# EAGLE schematic full_schema (EAGLE 9.6.2)
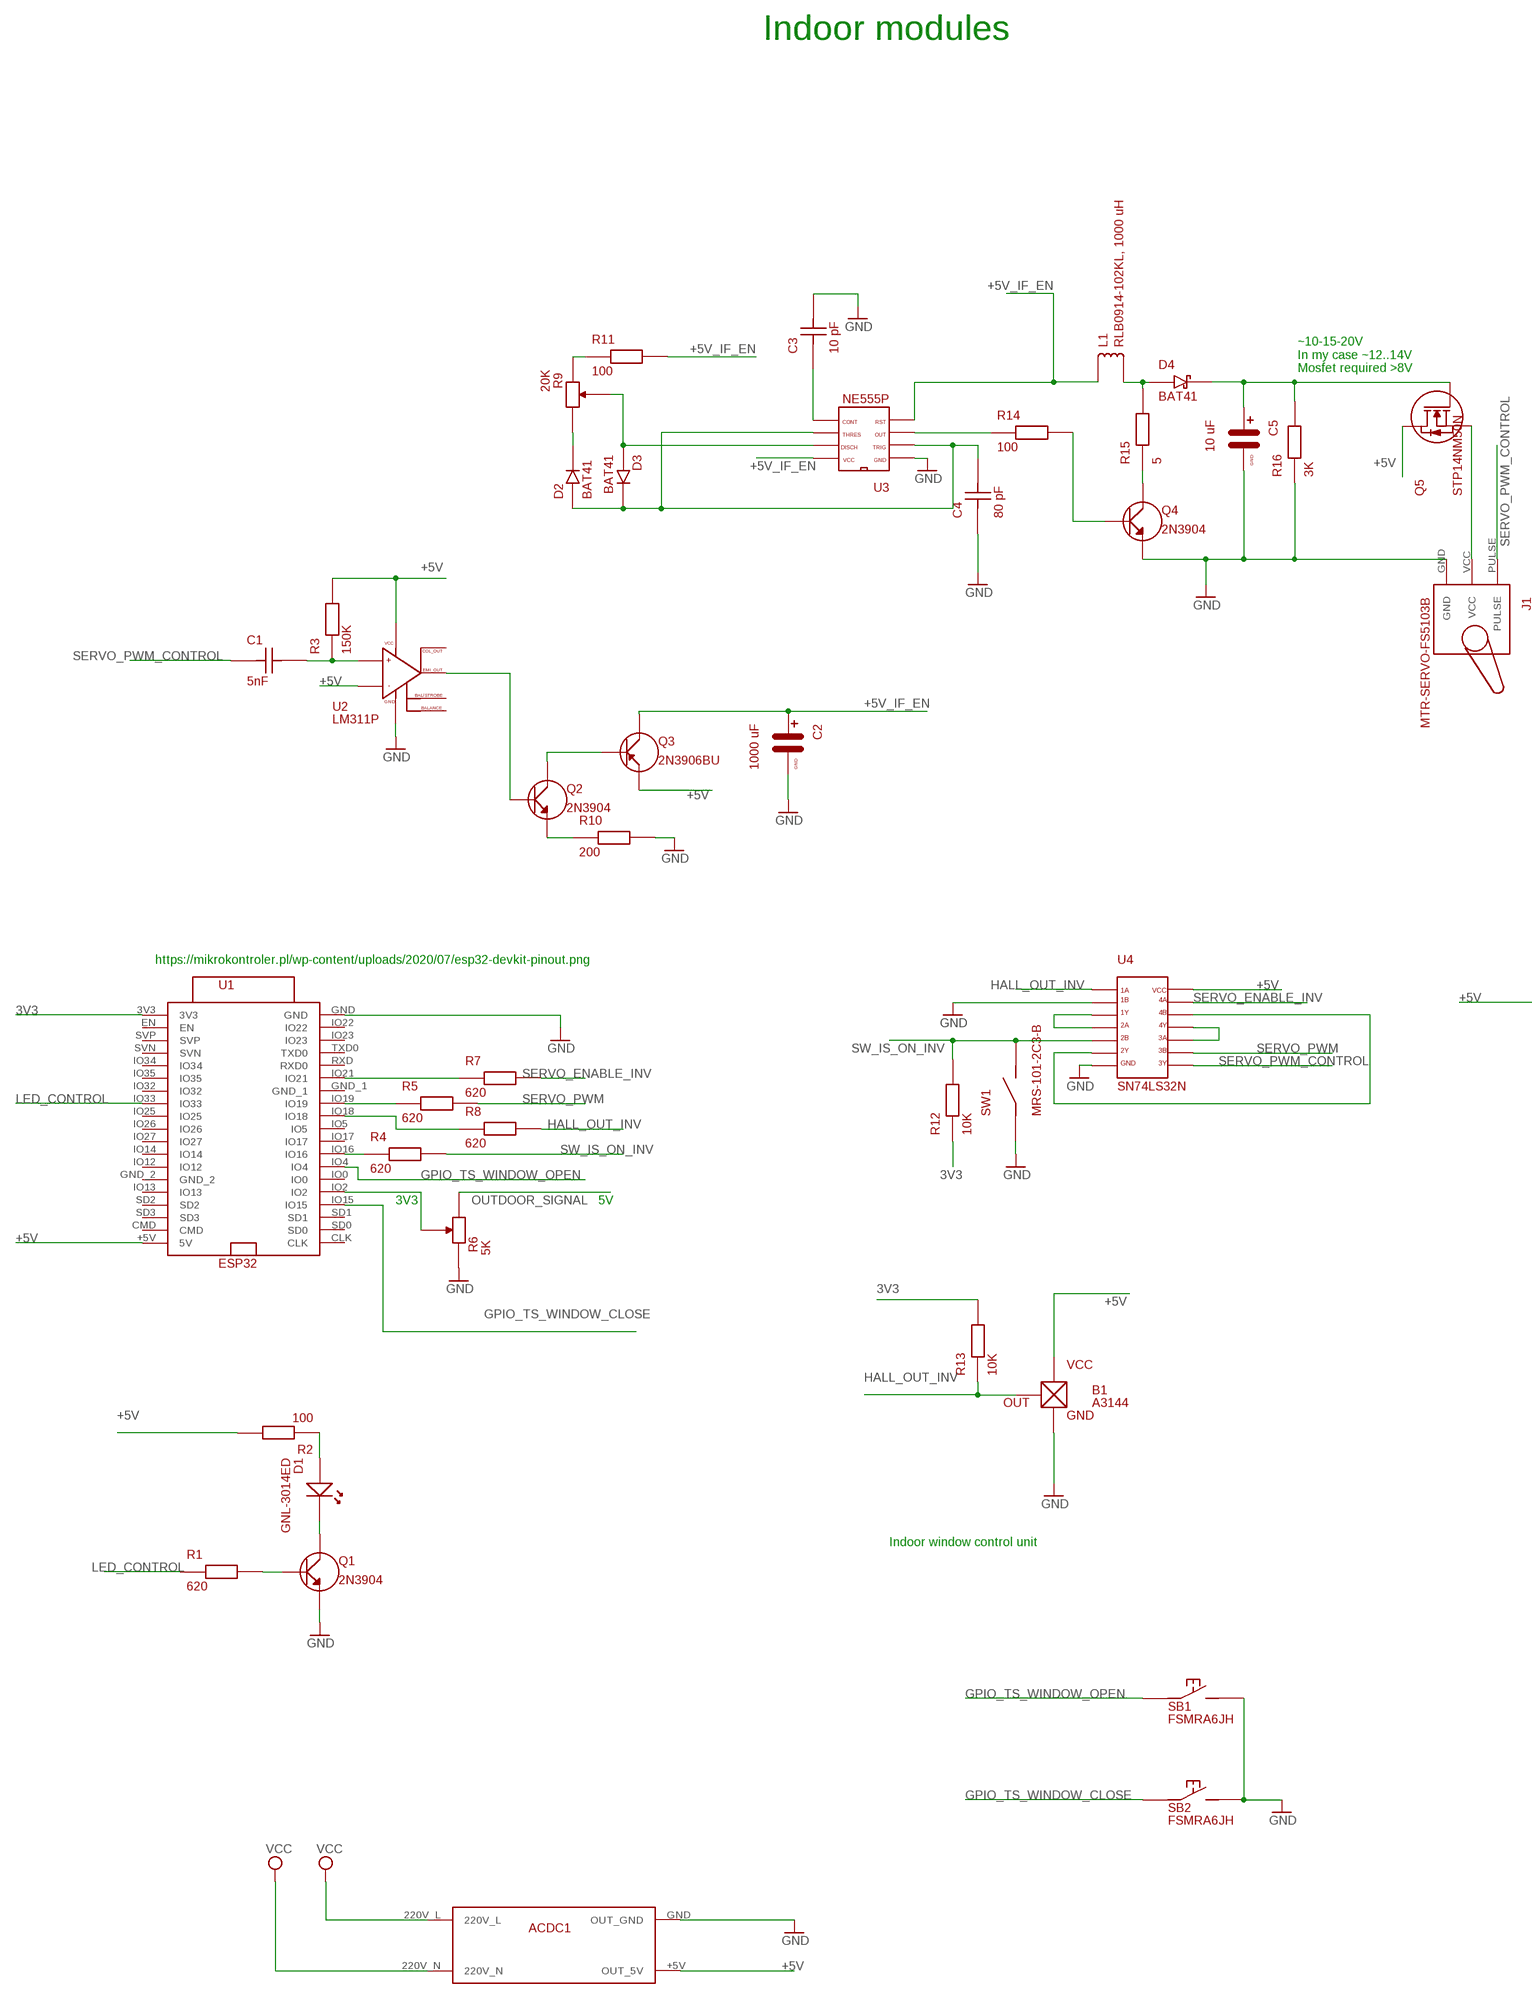
[diagram p0: schematic, sheet 1, part 1 of 2]
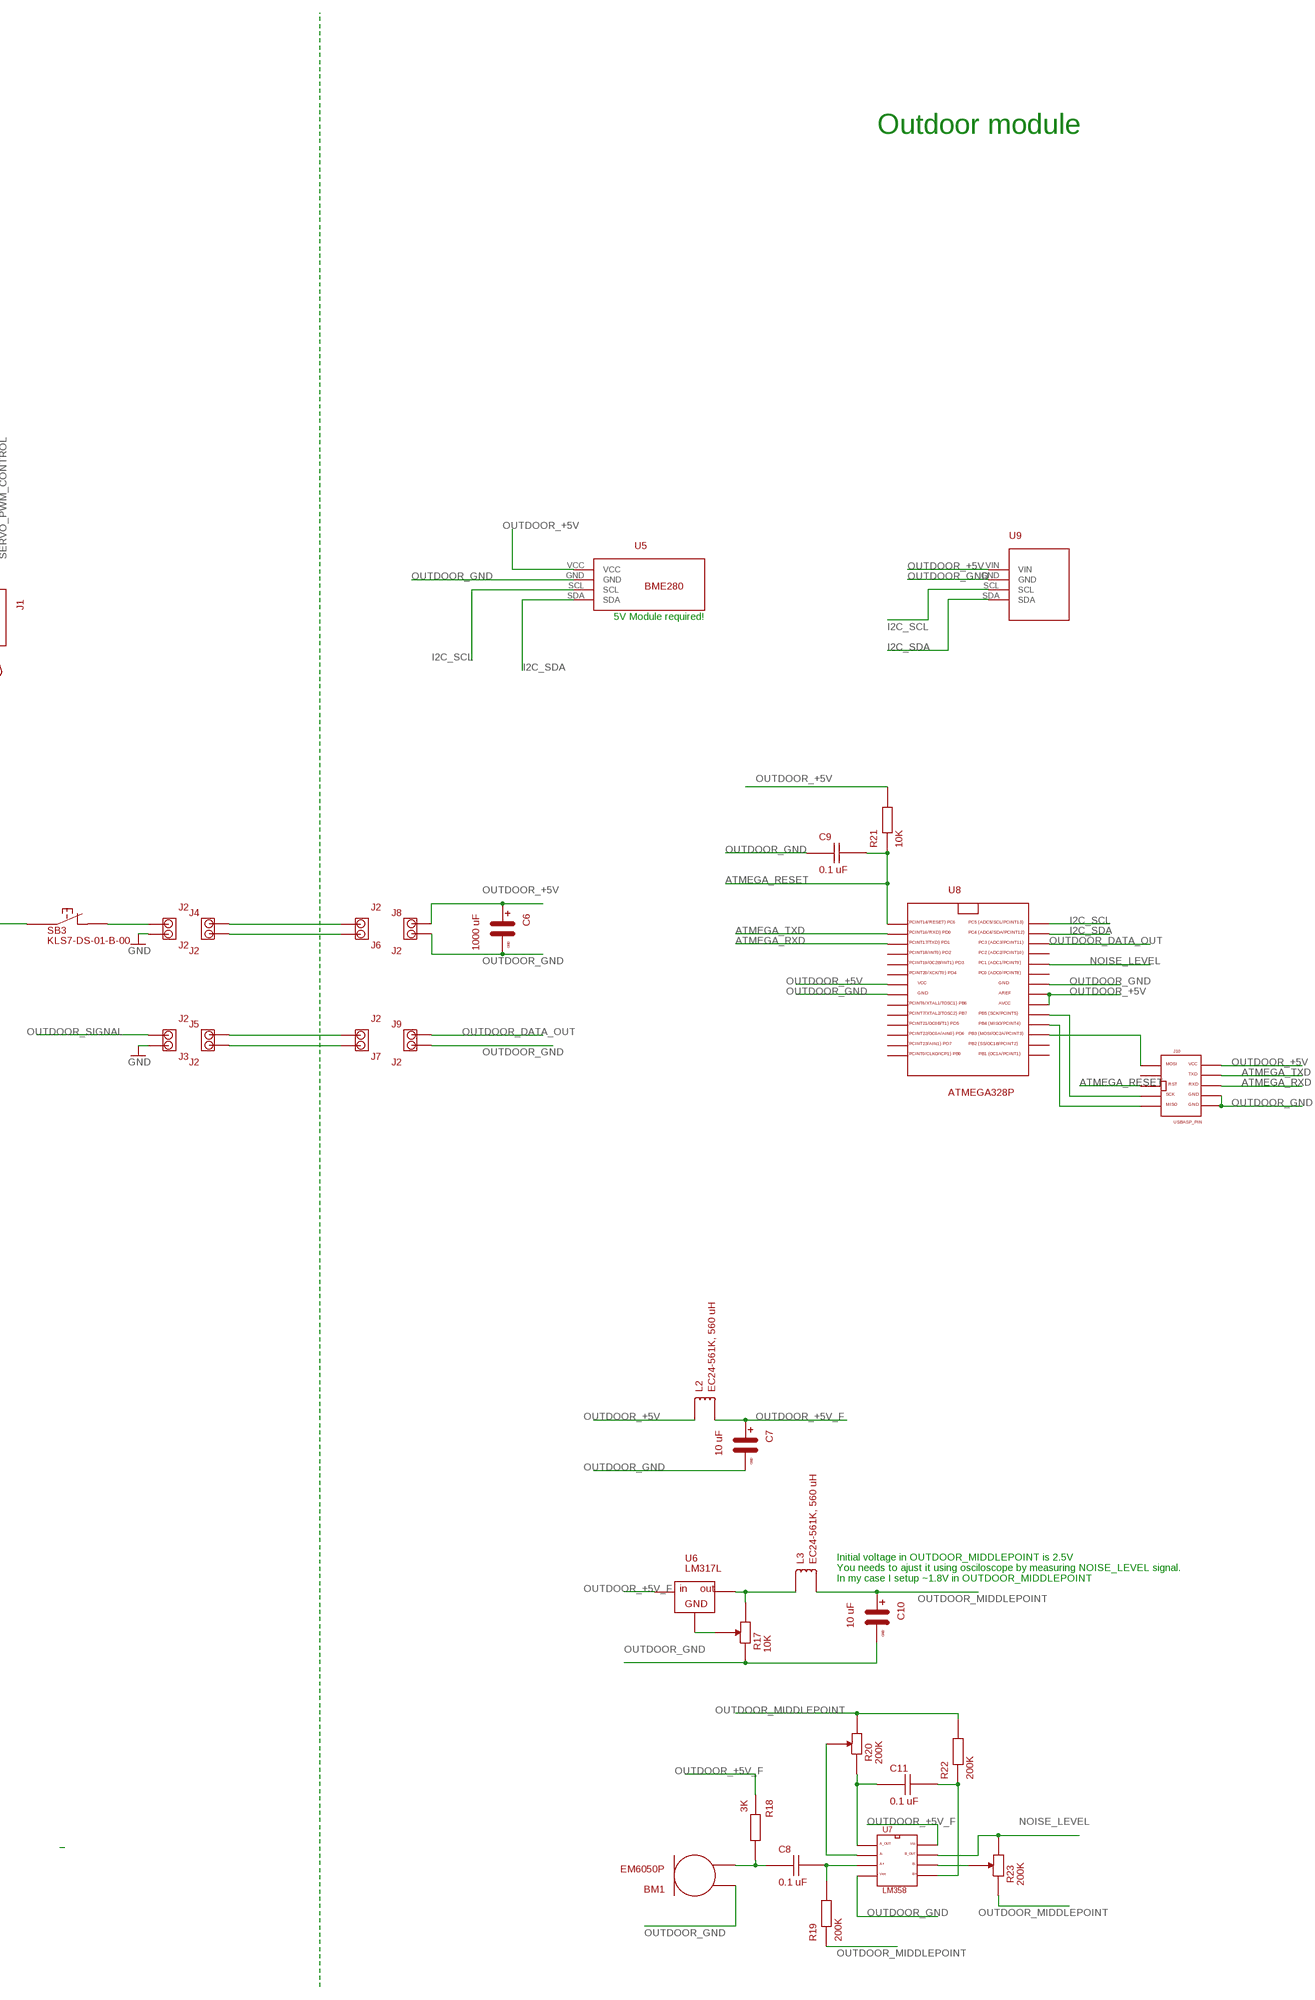
[diagram p1: schematic, sheet 1, part 2 of 2]

## Parts
ACDC1  ACDC  [ACDC]
B1  A3144  HALL_SENSOR  [HALL_SENSOR]
BM1  EM6050P  MICROPHONE  [MICROPHONE]
C1  5nF  C-1  [C-1]
C2  1000 uF  C  [C]
C3  10 pF  C-1  [C-1]
C4  80 pF  C-1  [C-1]
C5  10 uF  C  [C]
C6  1000 uF  C  [C]
C7  10 uF  C  [C]
C8  0.1 uF  C-1  [C-1]
C9  0.1 uF  C-1  [C-1]
C10  10 uF  C  [C]
C11  0.1 uF  C-1  [C-1]
D1  GNL-3014ED  LD  [LD]
D2  BAT41  D  [D]
D3  BAT41  D  [D]
D4  BAT41  D_SCHOTTKY  [D_SCHOTTKY]
J1  MTR-SERVO-FS5103B  SERVO  [SERVO]
J2  J2  [J2]
J3  J2  [J2]
J4  J2  [J2]
J5  J2  [J2]
J6  J2  [J2]
J7  J2  [J2]
J8  J2  [J2]
J9  J2  [J2]
J10  USBASP_PIN  [USBASP_PIN]
L1  RLB0914-102KL, 1000 uH  L  [L-RLB0914]
L2  EC24-561K, 560 uH  LL-EC24  [L-EC24]
L3  EC24-561K, 560 uH  LL-EC24  [L-EC24]
Q1  2N3904  TRANSISTOR_NPN  [TRANSISTOR]
Q2  2N3904  TRANSISTOR_NPN  [TRANSISTOR]
Q3  2N3906BU  TRANSISTOR_PNP  [TRANSISTOR]
Q4  2N3904  TRANSISTOR_NPN  [TRANSISTOR]
Q5  STP14NM50N  MOSFET_N  [MOSFET_N]
R1  620  R  [R]
R2  100  R  [R]
R3  150K  R  [R]
R4  620  R  [R]
R5  620  R  [R]
R6  5K  RD  [RD-3362H]
R7  620  R  [R]
R8  620  R  [R]
R9  20K  RD  [RD-3362H]
R10  200  R  [R]
R11  100  R  [R]
R12  10K  R  [R]
R13  10K  R  [R]
R14  100  R  [R]
R15  5  R  [R]
R16  3K  R  [R]
R17  10K  RD  [RD-3362H]
R18  3K  R  [R]
R19  200K  R  [R]
R20  200K  RD3296-Z  [RD-3296Z]
R21  10K  R  [R]
R22  200K  R  [R]
R23  200K  RD3296-Z  [RD-3296Z]
SB1  FSMRA6JH  SB-NO  [SB-NO-SPST-ANGLE]
SB2  FSMRA6JH  SB-NO  [SB-NO-SPST-ANGLE]
SB3  KLS7-DS-01-B-00  SB-NC  [SB-NC]
SW1  MRS-101-2C3-B  SWITCH  [SWITCH]
U1  ESP32  [ESP32]
U2  LM311P  [DIP8]
U3  NE555P  [DIP8]
U4  SN74LS32N  [DIP14]
U5  BMP280 5V module  BME280  [BME280]
U6  LM317L  VOLTAGE_REGULATOR  [VOLTAGE_REGULATOR]
U7  LM358  [DIP8]
U8  ATMEGA328P  [ATMEGA328P]
U9  GY-SGP30  [GY-SGP30]

## Nets
3V3: R12.P$1 R13.P$2 U1.3V3
+5V: ACDC1.+5V(OUT_5V) B1.VCC Q3.E Q5.D R2.P$2 R3.P$2 SB3.P$1 U1.+5V(5V) U2.PIN_3(IN-) U2.PIN_8(VCC) U4.PIN_14(VCC)
+5V_IF_EN: C2.PIN_PLUS L1.P$1 Q3.C R11.P$2 U3.PIN_4(RESET) U3.PIN_8(VCC)
ATMEGA_RESET: C9.P$2 J10.RST(RESET) R21.P$1 U8.PC6
ATMEGA_RXD: J10.RXD U8.PD1
ATMEGA_TXD: J10.TXD U8.PD0
GND: ACDC1.GND(OUT_GND) B1.GND C2.PIN_GND C3.P$2 C4.P$1 C5.PIN_GND J1.GND J2.PIN_1 J3.PIN_1 Q1.E Q4.E R6.P1 R10.P$2 R16.P$1 SB1.B SB2.B SW1.P$1 U1.GND U2.PIN_4(GND) U3.PIN_1(GND) U4.PIN_2(1B) U4.PIN_7(GND)
GPIO_TS_WINDOW_CLOSE: SB2.A U1.IO15
GPIO_TS_WINDOW_OPEN: SB1.A U1.IO4
HALL_OUT_INV: B1.OUT R8.P$2 R13.P$1 U4.PIN_1(1A)
I2C_SCL: U5.SCL U8.PC5 U9.SCL
I2C_SDA: U5.SDA U8.PC4 U9.SDA
LED_CONTROL: R1.P$1 U1.IO33
N$1: Q4.C R15.P$1
N$2: Q4.B R14.P$2
N$3: U4.PIN_6(2Y) U4.PIN_12(4B)
N$5: Q1.B R1.P$2
N$6: R5.P$1 U1.IO19
N$7: D1.PIN_ANODE Q1.C
N$8: D1.PIN_CATHODE R2.P$1
N$9: J4.PIN_1 J6.PIN_2
N$10: J4.PIN_2 J6.PIN_1
N$11: J5.PIN_1 J7.PIN_2
N$12: J5.PIN_2 J7.PIN_1
N$13: R6.P3 U1.IO2
N$14: BM1.P$2 C8.P$1 R18.P$2
N$15: C8.P$2 R19.P$2 U7.PIN_3(A+)
N$16: J2.PIN_2 SB3.P$2
N$17: R17.P3 U6.GND
N$18: C11.P$1 R20.P1 U7.PIN_1(A_OUT)
N$19: R23.P3 U7.PIN_6(B-)
N$20: C11.P$2 R22.P$1 U7.PIN_5(B+)
N$21: R20.P3 U7.PIN_2(A-)
N$24: J10.MOSI U8.PB3
N$25: J10.MISO U8.PB4
N$26: J10.SCK U8.PB5
N$28: R7.P$1 U1.IO21
N$29: R8.P$1 U1.IO18
N$32: R4.P$1 U1.IO16
N$35: R14.P$1 U3.PIN_3(OUT)
N$37: Q2.C Q3.B
N$38: Q2.E R10.P$1
N$39: D4.ANODE L1.P$2 R15.P$2
N$40: J1.VCC Q5.S
N$44: C3.P$1 U3.PIN_5(CONT)
N$46: C4.P$2 D2.P$1 D3.P$2 U3.PIN_2(TRIG) U3.PIN_6(THRES)
N$47: D3.P$1 R9.P3 U3.PIN_7(DISCH)
N$48: D2.P$2 R9.P2
N$49: R9.P1 R11.P$1
N$50: Q2.B U2.PIN_1(EMI_OUT)
N$51: C5.PIN_PLUS D4.CATHODE Q5.G R16.P$2
N$52: U4.PIN_10(3A) U4.PIN_11(4Y)
N$53: C1.P$2 R3.P$1 U2.PIN_2(IN+)
N$56: U4.PIN_3(1Y) U4.PIN_4(2A)
NOISE_LEVEL: R23.P2 U7.PIN_7(B_OUT) U8.PC1
OUT: L3.P$1 R17.P2 U6.OUT
OUTDOOR_+5V: C6.PIN_PLUS J8.PIN_1 J10.VCC L2.P$1 R21.P$2 U5.VCC U8.AREF U8.AVCC U8.VCC U9.VIN
OUTDOOR_+5V_F: C7.PIN_PLUS L2.P$2 R18.P$1 U6.IN U7.PIN_8(VCC)
OUTDOOR_DATA_OUT: J9.PIN_1 U8.PC3
OUTDOOR_GND: BM1.P$1 C6.PIN_GND C7.PIN_GND C9.P$1 C10.PIN_GND J8.PIN_2 J9.PIN_2 J10.GND J10.GND1 R17.P1 U5.GND U7.PIN_4(VEE) U8.GND U8.GND1 U9.GND
OUTDOOR_MIDDLEPOINT: C10.PIN_PLUS L3.P$2 R19.P$1 R20.P2 R22.P$2 R23.P1
OUTDOOR_SIGNAL: J3.PIN_2 R6.P2
SERVO_ENABLE_INV: R7.P$2 U4.PIN_13(4A)
SERVO_PWM: R5.P$2 U4.PIN_9(3B)
SERVO_PWM_CONTROL: C1.P$1 J1.PULSE U4.PIN_8(3Y)
SW_IS_ON_INV: R4.P$2 R12.P$2 SW1.P$2 U4.PIN_5(2B)
VCC: ACDC1.220V_L ACDC1.220V_N
Unconnected: J10.NC1 U1.CLK U1.CMD U1.EN U1.GND_1 U1.GND_2 U1.IO0 U1.IO5 U1.IO12 U1.IO13 U1.IO14 U1.IO17 U1.IO22 U1.IO23 U1.IO25 U1.IO26 U1.IO27 U1.IO32 U1.IO34 U1.IO35 U1.RXD(RXD0) U1.SD0 U1.SD1 U1.SD2 U1.SD3 U1.SVN U1.SVP U1.TXD0 U2.PIN_5(BALANCE) U2.PIN_6(BAL_STROBE) U2.PIN_7(COL_OUT) U8.PB0 U8.PB1 U8.PB2 U8.PB6 U8.PB7 U8.PC0 U8.PC2 U8.PD2 U8.PD3 U8.PD4 U8.PD5 U8.PD6 U8.PD7

## Notes on the sheet
- Outdoor module
- Indoor modules
- ~10-15-20V
  In my case ~12..14V
  Mosfet required >8V
- 5V Module required!
- https://mikrokontroler.pl/wp-content/uploads/2020/07/esp32-devkit-pinout.png
- 3V3 | 5V
- Indoor window control unit
- Initial voltage in OUTDOOR_MIDDLEPOINT is 2.5V
  You needs to ajust it using osciloscope by measuring NOISE_LEVEL signal.
  In my case I setup ~1.8V in OUTDOOR_MIDDLEPOINT

## Library data of the parts
ACDC1 = my_devices:ACDC
B1 = my_devices:HALL_SENSOR
BM1 = my_devices:MICROPHONE
C1 C3 C4 C8 C9 C11 = my_devices:C-1
C2 C5-C7 C10 = my_devices:C
D1 = my_devices:LD
D2 D3 = my_devices:D
D4 = my_devices:D_SCHOTTKY
J1 = my_devices:SERVO
J2-J9 = my_devices:J2
J10 = my_devices:USBASP_PIN
L1-L3 = my_devices:L
Q1 Q2 Q4 = my_devices:TRANSISTOR_NPN
Q3 = my_devices:TRANSISTOR_PNP
Q5 = my_devices:MOSFET_N
R1-R5 R7 R8 R10-R16 R18 R19 R21 R22 = my_devices:R
R6 R9 R17 R20 R23 = my_devices:RD
SB1 SB2 = my_devices:SB-NO
SB3 = my_devices:SB-NC
SW1 = my_devices:SWITCH
U1 = my_devices:ESP32
U2 = my_devices:LM311P
U3 = my_devices:NE555P
U4 = my_devices:SN74LS32N
U5 = my_devices:BME280
U6 = my_devices:VOLTAGE_REGULATOR
U7 = my_devices:LM358
U8 = my_devices:ATMEGA328P
U9 = my_devices:GY-SGP30